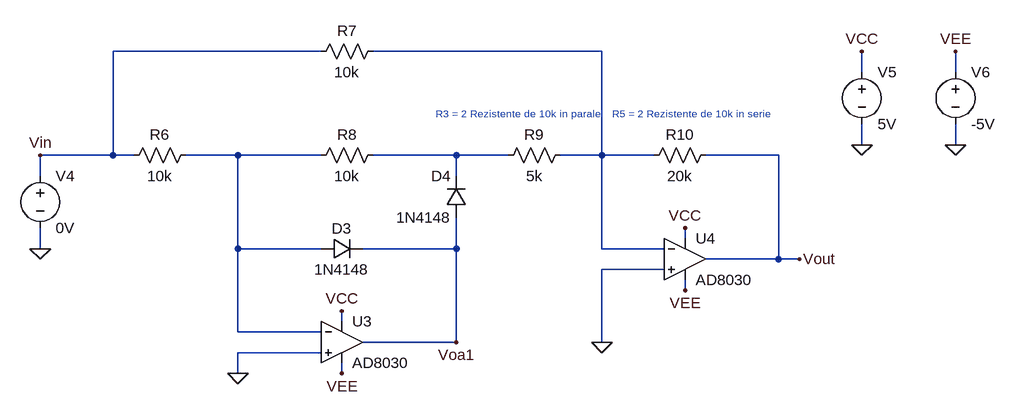
[diagram p0: schematic Etaj 4 - Transient_ implementare functie de circuit.asc]
Etaj 4 - Transient_ implementare functie de circuit.asc, the LTspice schematic file:
Version 4.1
SHEET 1 1540 1096
WIRE 400 80 80 80
WIRE 832 80 480 80
WIRE 1232 112 1232 80
WIRE 1376 112 1376 80
WIRE 1232 224 1232 192
WIRE 1376 224 1376 192
WIRE 80 240 80 80
WIRE 80 240 -32 240
WIRE 112 240 80 240
WIRE 272 240 192 240
WIRE 400 240 272 240
WIRE 608 240 480 240
WIRE 688 240 608 240
WIRE 832 240 832 80
WIRE 832 240 768 240
WIRE 912 240 832 240
WIRE 1104 240 992 240
WIRE -32 272 -32 240
WIRE 608 272 608 240
WIRE 960 368 960 352
WIRE -32 384 -32 352
WIRE 272 384 272 240
WIRE 400 384 272 384
WIRE 608 384 608 336
WIRE 608 384 464 384
WIRE 832 384 832 240
WIRE 928 384 832 384
WIRE 1104 400 1104 240
WIRE 1104 400 992 400
WIRE 1136 400 1104 400
WIRE 928 416 832 416
WIRE 960 448 960 432
WIRE 432 496 432 480
WIRE 272 512 272 384
WIRE 400 512 272 512
WIRE 608 528 608 384
WIRE 608 528 464 528
WIRE 832 528 832 416
WIRE 400 544 272 544
WIRE 272 576 272 544
WIRE 432 576 432 560
FLAG 272 576 0
FLAG -32 384 0
FLAG 832 528 0
FLAG 1232 224 0
FLAG 1376 224 0
FLAG 1232 80 VCC
FLAG 1376 80 VEE
FLAG 960 352 VCC
FLAG 432 480 VCC
FLAG 960 448 VEE
FLAG 432 576 VEE
FLAG 1136 400 Vout
FLAG -32 240 Vin
FLAG 608 528 Voa1
SYMBOL voltage -32 256 R0
WINDOW 123 0 0 Left 0
WINDOW 39 0 0 Left 0
SYMATTR InstName V4
SYMATTR Value 0V
SYMBOL res 208 224 R90
WINDOW 0 0 56 VBottom 2
WINDOW 3 32 56 VTop 2
SYMATTR InstName R6
SYMATTR Value 10k
SYMBOL res 496 64 R90
WINDOW 0 0 56 VBottom 2
WINDOW 3 32 56 VTop 2
SYMATTR InstName R7
SYMATTR Value 10k
SYMBOL res 496 224 R90
WINDOW 0 0 56 VBottom 2
WINDOW 3 32 56 VTop 2
SYMATTR InstName R8
SYMATTR Value 10k
SYMBOL diode 400 400 R270
WINDOW 0 32 32 VTop 2
WINDOW 3 0 32 VBottom 2
SYMATTR InstName D3
SYMATTR Value 1N4148
SYMBOL diode 624 336 R180
WINDOW 0 24 64 Left 2
WINDOW 3 24 0 Left 2
SYMATTR InstName D4
SYMATTR Value 1N4148
SYMBOL res 784 224 R90
WINDOW 0 0 56 VBottom 2
WINDOW 3 32 56 VTop 2
SYMATTR InstName R9
SYMATTR Value 5k
SYMBOL OpAmps\\AD8030 432 464 R0
SYMATTR InstName U3
SYMBOL res 1008 224 R90
WINDOW 0 0 56 VBottom 2
WINDOW 3 32 56 VTop 2
SYMATTR InstName R10
SYMATTR Value 20k
SYMBOL OpAmps\\AD8030 960 336 R0
SYMATTR InstName U4
SYMBOL voltage 1232 96 R0
WINDOW 123 0 0 Left 0
WINDOW 39 0 0 Left 0
SYMATTR InstName V5
SYMATTR Value 5V
SYMBOL voltage 1376 96 R0
WINDOW 123 0 0 Left 0
WINDOW 39 0 0 Left 0
SYMATTR InstName V6
SYMATTR Value -5V
TEXT 848 176 Left 1 ;R5 = 2 Rezistente de 10k in serie
TEXT 576 176 Left 1 ;R3 = 2 Rezistente de 10k in paralel

The netlist it stands for:
* Etaj 4 - Transient_ implementare functie de circuit.asc
V4 Vin 0 0V
R6 N002 Vin 10k
R7 N001 Vin 10k
R8 N003 N002 10k
D3 N002 Voa1 1N4148
D4 Voa1 N003 1N4148
R9 N001 N003 5k
X§U3 0 N002 VCC VEE Voa1 AD8040  ; AD8030, pins In+ In- V+ V- OUT
R10 Vout N001 20k
X§U4 0 N001 VCC VEE Vout AD8040  ; AD8030, pins In+ In- V+ V- OUT
V5 VCC 0 5V
V6 VEE 0 -5V
.model D D
.lib standard.dio
* R5 = 2 Rezistente de 10k in serie
* R3 = 2 Rezistente de 10k in paralel
.lib ADI.lib
.backanno
.end